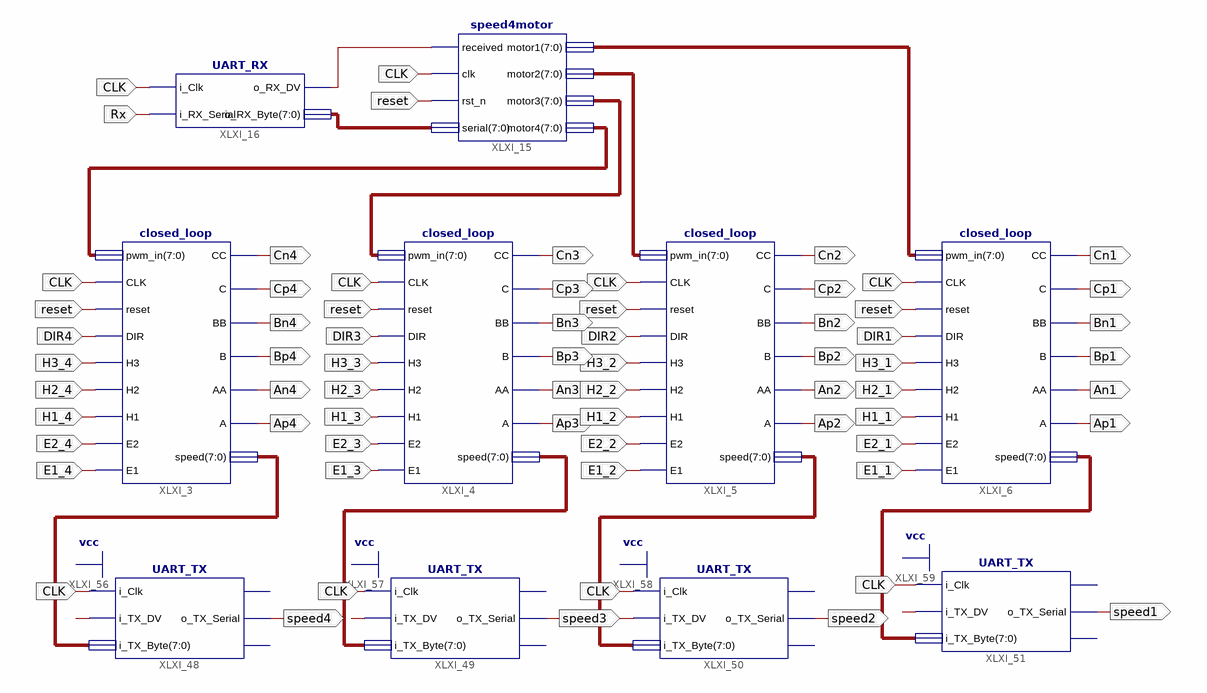
[diagram p0: schematic sheet 1]
// Xilinx ISE schematic ssl.sch (spartan6) as structural Verilog: 10 symbols, 55 ports
module ssl (
  input  CLK,
  input  reset,
  input  DIR3,
  input  H3_3,
  input  DIR2,
  input  H3_2,
  input  H2_2,
  input  H1_2,
  input  E2_2,
  input  E1_2,
  input  H2_3,
  input  H1_3,
  input  E2_3,
  input  E1_3,
  input  DIR1,
  input  H3_1,
  input  H2_1,
  input  H1_1,
  input  E2_1,
  input  E1_1,
  input  DIR4,
  input  H3_4,
  input  H2_4,
  input  H1_4,
  input  E2_4,
  input  E1_4,
  input  Rx,
  output Ap3,
  output An3,
  output Bp3,
  output Bn3,
  output Cp3,
  output Cn3,
  output Cn2,
  output Cp2,
  output Bn2,
  output Bp2,
  output An2,
  output Ap2,
  output Cn1,
  output Cp1,
  output Bn1,
  output Bp1,
  output An1,
  output Ap1,
  output Ap4,
  output An4,
  output Bp4,
  output Bn4,
  output Cp4,
  output Cn4,
  output speed4,
  output speed3,
  output speed2,
  output speed1
);

  wire XLXN_1;
  wire [7:0] XLXN_2, XLXN_7, XLXN_9, XLXN_11, XLXN_13, XLXN_506, XLXN_526, XLXN_527, XLXN_528;

  closed_loop XLXI_4 (
    .pwm_in(XLXN_9), .CLK(CLK), .reset(reset), .DIR(DIR3), .H3(H3_3), .H2(H2_3), .H1(H1_3), .E2(E2_3),
    .E1(E1_3), .CC(Cn3), .C(Cp3), .BB(Bn3), .B(Bp3), .AA(An3), .A(Ap3), .speed(XLXN_526));
  closed_loop XLXI_5 (
    .pwm_in(XLXN_11), .CLK(CLK), .reset(reset), .DIR(DIR2), .H3(H3_2), .H2(H2_2), .H1(H1_2), .E2(E2_2),
    .E1(E1_2), .CC(Cn2), .C(Cp2), .BB(Bn2), .B(Bp2), .AA(An2), .A(Ap2), .speed(XLXN_527));
  closed_loop XLXI_6 (
    .pwm_in(XLXN_13), .CLK(CLK), .reset(reset), .DIR(DIR1), .H3(H3_1), .H2(H2_1), .H1(H1_1), .E2(E2_1),
    .E1(E1_1), .CC(Cn1), .C(Cp1), .BB(Bn1), .B(Bp1), .AA(An1), .A(Ap1), .speed(XLXN_528));
  closed_loop XLXI_3 (
    .pwm_in(XLXN_7), .CLK(CLK), .reset(reset), .DIR(DIR4), .H3(H3_4), .H2(H2_4), .H1(H1_4), .E2(E2_4),
    .E1(E1_4), .CC(Cn4), .C(Cp4), .BB(Bn4), .B(Bp4), .AA(An4), .A(Ap4), .speed(XLXN_506));
  speed4motor XLXI_15 (
    .received(XLXN_1), .clk(CLK), .rst_n(reset), .serial(XLXN_2), .motor1(XLXN_13), .motor2(XLXN_11),
    .motor3(XLXN_9), .motor4(XLXN_7));
  UART_RX XLXI_16 (.i_Clk(CLK), .i_RX_Serial(Rx), .o_RX_DV(XLXN_1), .o_RX_Byte(XLXN_2));
  UART_TX XLXI_51 (
    .i_Clk(CLK), .i_TX_DV(1'b1), .i_TX_Byte(XLXN_528), .o_TX_Serial(speed1));  // open: o_TX_Active, o_TX_Done
  UART_TX XLXI_50 (
    .i_Clk(CLK), .i_TX_DV(1'b1), .i_TX_Byte(XLXN_527), .o_TX_Serial(speed2));  // open: o_TX_Active, o_TX_Done
  UART_TX XLXI_49 (
    .i_Clk(CLK), .i_TX_DV(1'b1), .i_TX_Byte(XLXN_526), .o_TX_Serial(speed3));  // open: o_TX_Active, o_TX_Done
  UART_TX XLXI_48 (
    .i_Clk(CLK), .i_TX_DV(1'b1), .i_TX_Byte(XLXN_506), .o_TX_Serial(speed4));  // open: o_TX_Active, o_TX_Done
endmodule
